# Altium schematic sheet Power.SchDoc
size 584 x 381 mm
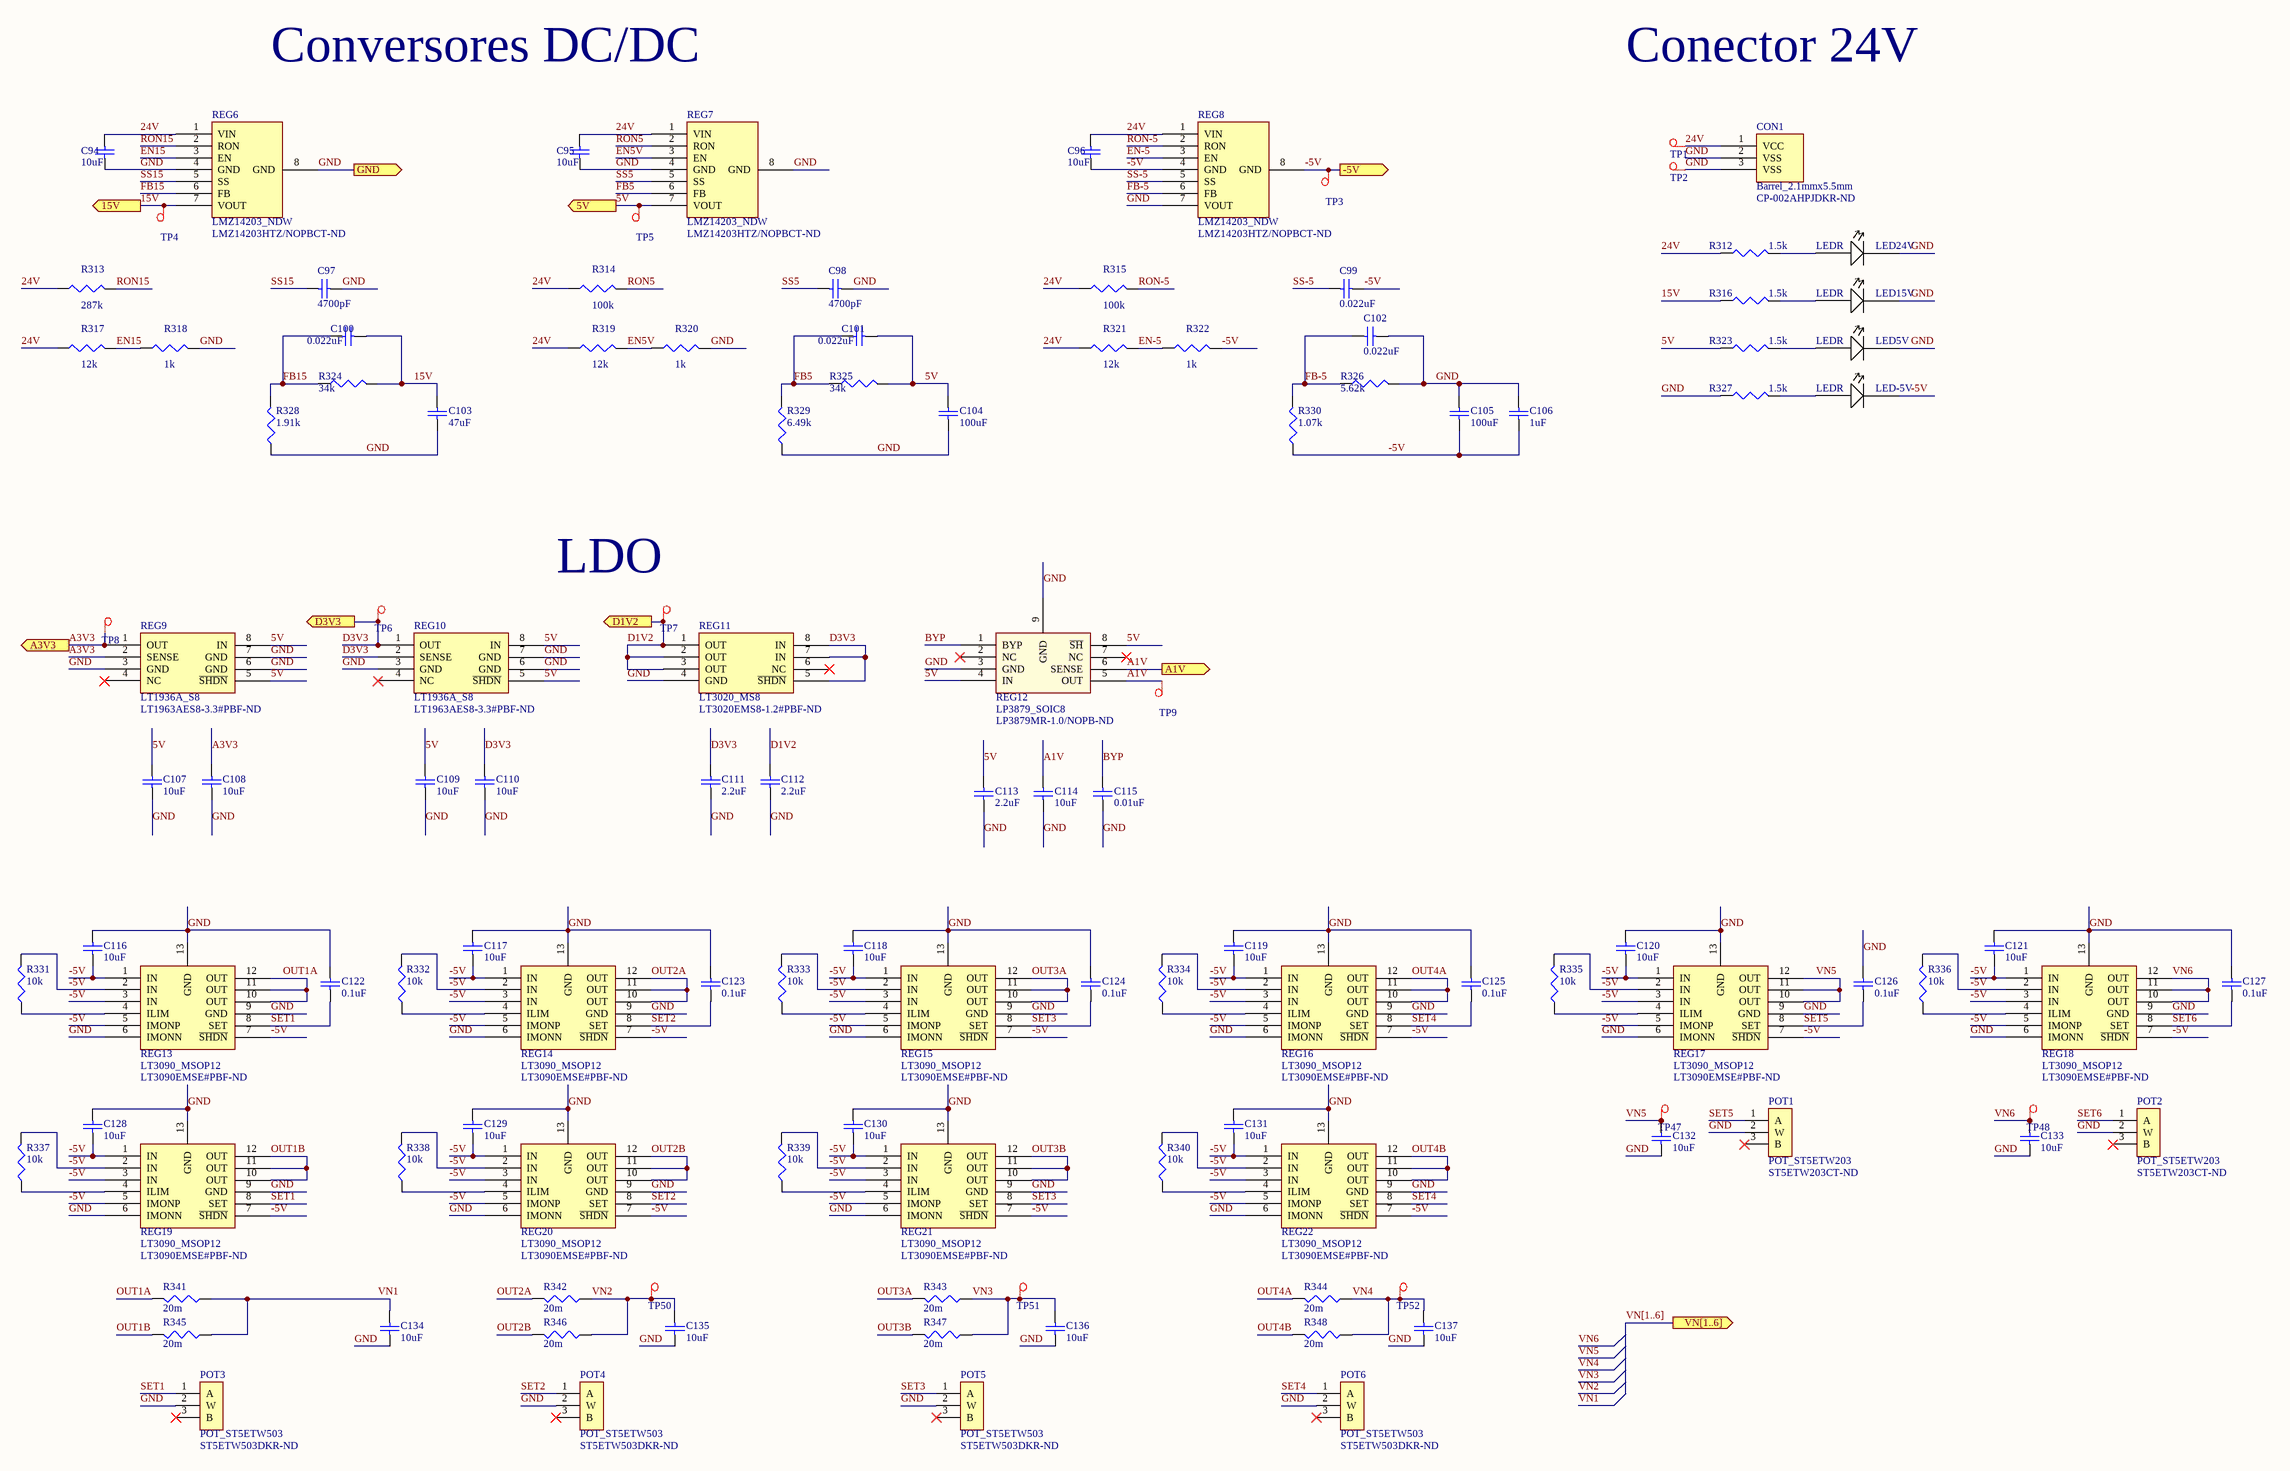
[diagram p0: Power.SchDoc]

## Parts
C94  value 10uF  [RES_1206]  (hidden comment: Cap)
C95  value 10uF  [RES_1206]  (hidden comment: Cap)
C96  value 10uF  [RES_1206]  (hidden comment: Cap)
C97  value 4700pF  [J1-0603]  (hidden comment: Cap)
C98  value 4700pF  [J1-0603]  (hidden comment: Cap)
C99  value 0.022uF  [J1-0603]  (hidden comment: Cap)
C100  value 0.022uF  [J1-0603]  (hidden comment: Cap)
C101  value 0.022uF  [J1-0603]  (hidden comment: Cap)
C102  value 0.022uF  [J1-0603]  (hidden comment: Cap)
C103  value 47uF  [RES_1206]  (hidden comment: Cap)
C104  value 100uF  [J1-0603]  (hidden comment: Cap)
C105  value 100uF  [J1-0603]  (hidden comment: Cap)
C106  value 1uF  [J1-0603]  (hidden comment: Cap)
C107  value 10uF  [RES_0805]  (hidden comment: Cap)
C108  value 10uF  [RES_0805]  (hidden comment: Cap)
C109  value 10uF  [RES_0805]  (hidden comment: Cap)
C110  value 10uF  [RES_0805]  (hidden comment: Cap)
C111  value 2.2uF  [J1-0603]  (hidden comment: Cap)
C112  value 2.2uF  [J1-0603]  (hidden comment: Cap)
C113  value 2.2uF  [J1-0603]  (hidden comment: Cap)
C114  value 10uF  [RES_0805]  (hidden comment: Cap)
C115  value 0.01uF  [J1-0603]  (hidden comment: Cap)
C116  value 10uF  [RES_0805]  (hidden comment: Cap)
C117  value 10uF  [RES_0805]  (hidden comment: Cap)
C118  value 10uF  [RES_0805]  (hidden comment: Cap)
C119  value 10uF  [RES_0805]  (hidden comment: Cap)
C120  value 10uF  [RES_0805]  (hidden comment: Cap)
C121  value 10uF  [RES_0805]  (hidden comment: Cap)
C122  value 0.1uF  [J1-0603]  (hidden comment: Cap)
C123  value 0.1uF  [J1-0603]  (hidden comment: Cap)
C124  value 0.1uF  [J1-0603]  (hidden comment: Cap)
C125  value 0.1uF  [J1-0603]  (hidden comment: Cap)
C126  value 0.1uF  [J1-0603]  (hidden comment: Cap)
C127  value 0.1uF  [J1-0603]  (hidden comment: Cap)
C128  value 10uF  [RES_0805]  (hidden comment: Cap)
C129  value 10uF  [RES_0805]  (hidden comment: Cap)
C130  value 10uF  [RES_0805]  (hidden comment: Cap)
C131  value 10uF  [RES_0805]  (hidden comment: Cap)
C132  value 10uF  [RES_0805]  (hidden comment: Cap)
C133  value 10uF  [RES_0805]  (hidden comment: Cap)
C134  value 10uF  [RES_0805]  (hidden comment: Cap)
C135  value 10uF  [RES_0805]  (hidden comment: Cap)
C136  value 10uF  [RES_0805]  (hidden comment: Cap)
C137  value 10uF  [RES_0805]  (hidden comment: Cap)
CON1  Barrel_2.1mmx5.5mm  Supplier Part Number 1: CP-002AHPJDKR-ND  [Barrel_2.1mmx5.5mm]
LED5V  LEDR  [LED]
LED15V  LEDR  [LED]
LED24V  LEDR  [LED]
LED-5V  LEDR  [LED]
POT1  POT_ST5ETW203  Supplier Part Number 1: ST5ETW203CT-ND  [POT_ST5ETW]
POT2  POT_ST5ETW203  Supplier Part Number 1: ST5ETW203CT-ND  [POT_ST5ETW]
POT3  POT_ST5ETW503  Supplier Part Number 1: ST5ETW503DKR-ND  [POT_ST5ETW]
POT4  POT_ST5ETW503  Supplier Part Number 1: ST5ETW503DKR-ND  [POT_ST5ETW]
POT5  POT_ST5ETW503  Supplier Part Number 1: ST5ETW503DKR-ND  [POT_ST5ETW]
POT6  POT_ST5ETW503  Supplier Part Number 1: ST5ETW503DKR-ND  [POT_ST5ETW]
R312  value 1.5k  [J1-0603]  (hidden comment: Res3)
R313  value 287k  [J1-0603]  (hidden comment: Res3)
R314  value 100k  [J1-0603]  (hidden comment: Res3)
R315  value 100k  [J1-0603]  (hidden comment: Res3)
R316  value 1.5k  [J1-0603]  (hidden comment: Res3)
R317  value 12k  [J1-0603]  (hidden comment: Res3)
R318  value 1k  [J1-0603]  (hidden comment: Res3)
R319  value 12k  [J1-0603]  (hidden comment: Res3)
R320  value 1k  [J1-0603]  (hidden comment: Res3)
R321  value 12k  [J1-0603]  (hidden comment: Res3)
R322  value 1k  [J1-0603]  (hidden comment: Res3)
R323  value 1.5k  [J1-0603]  (hidden comment: Res3)
R324  value 34k  [J1-0603]  (hidden comment: Res3)
R325  value 34k  [J1-0603]  (hidden comment: Res3)
R326  value 5.62k  [J1-0603]  (hidden comment: Res3)
R327  value 1.5k  [J1-0603]  (hidden comment: Res3)
R328  value 1.91k  [J1-0603]  (hidden comment: Res3)
R329  value 6.49k  [J1-0603]  (hidden comment: Res3)
R330  value 1.07k  [J1-0603]  (hidden comment: Res3)
R331  value 10k  [J1-0603]  (hidden comment: Res3)
R332  value 10k  [J1-0603]  (hidden comment: Res3)
R333  value 10k  [J1-0603]  (hidden comment: Res3)
R334  value 10k  [J1-0603]  (hidden comment: Res3)
R335  value 10k  [J1-0603]  (hidden comment: Res3)
R336  value 10k  [J1-0603]  (hidden comment: Res3)
R337  value 10k  [J1-0603]  (hidden comment: Res3)
R338  value 10k  [J1-0603]  (hidden comment: Res3)
R339  value 10k  [J1-0603]  (hidden comment: Res3)
R340  value 10k  [J1-0603]  (hidden comment: Res3)
R341  value 20m  [J1-0603]  (hidden comment: Res3)
R342  value 20m  [J1-0603]  (hidden comment: Res3)
R343  value 20m  [J1-0603]  (hidden comment: Res3)
R344  value 20m  [J1-0603]  (hidden comment: Res3)
R345  value 20m  [J1-0603]  (hidden comment: Res3)
R346  value 20m  [J1-0603]  (hidden comment: Res3)
R347  value 20m  [J1-0603]  (hidden comment: Res3)
R348  value 20m  [J1-0603]  (hidden comment: Res3)
REG6  LMZ14203_NDW  Supplier Part Number 1: LMZ14203HTZ/NOPBCT-ND  [LMZ14203_NDW]
REG7  LMZ14203_NDW  Supplier Part Number 1: LMZ14203HTZ/NOPBCT-ND  [LMZ14203_NDW]
REG8  LMZ14203_NDW  Supplier Part Number 1: LMZ14203HTZ/NOPBCT-ND  [LMZ14203_NDW]
REG9  LT1936A_S8  Supplier Part Number 1: LT1963AES8-3.3#PBF-ND  [LT1936A_S8]
REG10  LT1936A_S8  Supplier Part Number 1: LT1963AES8-3.3#PBF-ND  [LT1936A_S8]
REG11  LT3020_MS8  Supplier Part Number 1: LT3020EMS8-1.2#PBF-ND  [LT3020_MS8]
REG12  LP3879_SOIC8  Supplier Part Number 1: LP3879MR-1.0/NOPB-ND  [LP3879_SOIC8]
REG13  LT3090_MSOP12  Supplier Part Number 1: LT3090EMSE#PBF-ND  [LT3090_MSOP12]
REG14  LT3090_MSOP12  Supplier Part Number 1: LT3090EMSE#PBF-ND  [LT3090_MSOP12]
REG15  LT3090_MSOP12  Supplier Part Number 1: LT3090EMSE#PBF-ND  [LT3090_MSOP12]
REG16  LT3090_MSOP12  Supplier Part Number 1: LT3090EMSE#PBF-ND  [LT3090_MSOP12]
REG17  LT3090_MSOP12  Supplier Part Number 1: LT3090EMSE#PBF-ND  [LT3090_MSOP12]
REG18  LT3090_MSOP12  Supplier Part Number 1: LT3090EMSE#PBF-ND  [LT3090_MSOP12]
REG19  LT3090_MSOP12  Supplier Part Number 1: LT3090EMSE#PBF-ND  [LT3090_MSOP12]
REG20  LT3090_MSOP12  Supplier Part Number 1: LT3090EMSE#PBF-ND  [LT3090_MSOP12]
REG21  LT3090_MSOP12  Supplier Part Number 1: LT3090EMSE#PBF-ND  [LT3090_MSOP12]
REG22  LT3090_MSOP12  Supplier Part Number 1: LT3090EMSE#PBF-ND  [LT3090_MSOP12]
TP1  Test Point  [TestPoint]  (value not drawn)
TP2  Test Point  [TestPoint]  (value not drawn)
TP3  Test Point  [TestPoint]  (value not drawn)
TP4  Test Point  [TestPoint]  (value not drawn)
TP5  Test Point  [TestPoint]  (value not drawn)
TP6  Test Point  [TestPoint]  (value not drawn)
TP7  Test Point  [TestPoint]  (value not drawn)
TP8  Test Point  [TestPoint]  (value not drawn)
TP9  Test Point  [TestPoint]  (value not drawn)
TP47  Test Point  [TestPoint]  (value not drawn)
TP48  Test Point  [TestPoint]  (value not drawn)
TP50  Test Point  [TestPoint]  (value not drawn)
TP51  Test Point  [TestPoint]  (value not drawn)
TP52  Test Point  [TestPoint]  (value not drawn)

## Ports
5V (out), 15V (out), -5V (out), A1V (out), A3V3 (out), D1V2 (out), D3V3 (out), GND (out), VN[1..6] (out)

## Nets
5V: C101.1 C104.1 C107.1 C109.1 C113.1 R323.1 R325.2 REG7.7(VOUT) REG9.5(~{SHDN}) REG9.8(IN) REG10.5(~{SHDN}) REG10.8(IN) REG12.4(IN) REG12.8(~{SH}) TP5.1(TP) ; port 5V
15V: C100.1 C103.1 R316.1 R324.2 REG6.7(VOUT) TP4.1(TP) ; port 15V
24V: C94.2 C95.2 C96.2 CON1.1(VCC) R312.1 R313.1 R314.1 R315.1 R317.1 R319.1 R321.1 REG6.1(VIN) REG7.1(VIN) REG8.1(VIN) TP1.1(TP)
-5V: C96.1 C99.1 C105.2 C106.2 C116.2 C117.2 C118.2 C119.2 C120.2 C121.2 C128.2 C129.2 C130.2 C131.2 LED-5V.2 R322.2 R330.1 R331.2 R332.2 R333.2 R334.2 R335.2 R336.2 R337.2 R338.2 R339.2 R340.2 REG8.4(GND) REG8.8(GND) REG13.1(IN) REG13.2(IN) REG13.3(IN) REG13.5(IMONP) REG13.7(~{SHDN}) REG14.1(IN) REG14.2(IN) REG14.3(IN) REG14.5(IMONP) REG14.7(~{SHDN}) REG15.1(IN) REG15.2(IN) REG15.3(IN) REG15.5(IMONP) REG15.7(~{SHDN}) REG16.1(IN) REG16.2(IN) REG16.3(IN) REG16.5(IMONP) REG16.7(~{SHDN}) REG17.1(IN) REG17.2(IN) REG17.3(IN) REG17.5(IMONP) REG17.7(~{SHDN}) REG18.1(IN) REG18.2(IN) REG18.3(IN) REG18.5(IMONP) REG18.7(~{SHDN}) REG19.1(IN) REG19.2(IN) REG19.3(IN) REG19.5(IMONP) REG19.7(~{SHDN}) REG20.1(IN) REG20.2(IN) REG20.3(IN) REG20.5(IMONP) REG20.7(~{SHDN}) REG21.1(IN) REG21.2(IN) REG21.3(IN) REG21.5(IMONP) REG21.7(~{SHDN}) REG22.1(IN) REG22.2(IN) REG22.3(IN) REG22.5(IMONP) REG22.7(~{SHDN}) TP3.1(TP) ; port -5V
A1V: C114.1 REG12.5(OUT) REG12.6(SENSE) TP9.1(TP) ; port A1V
A3V3: C108.1 REG9.1(OUT) REG9.2(SENSE) TP8.1(TP) ; port A3V3
BYP: C115.1 REG12.1(BYP)
D1V2: C112.1 REG11.1(OUT) REG11.2(OUT) REG11.3(OUT) TP7.1(TP) ; port D1V2
D3V3: C110.1 C111.1 REG10.1(OUT) REG10.2(SENSE) REG11.5(~{SHDN}) REG11.7(IN) REG11.8(IN) TP6.1(TP) ; port D3V3
EN5V: R319.2 R320.1 REG7.3(EN)
EN15: R317.2 R318.1 REG6.3(EN)
EN-5: R321.2 R322.1 REG8.3(EN)
FB5: C101.2 R325.1 R329.2 REG7.6(FB)
FB15: C100.2 R324.1 R328.2 REG6.6(FB)
FB-5: C102.2 R326.1 R330.2 REG8.6(FB)
GND: C94.1 C95.1 C97.1 C98.1 C102.1 C103.2 C104.2 C105.1 C106.1 C107.2 C108.2 C109.2 C110.2 C111.2 C112.2 C113.2 C114.2 C115.2 C116.1 C117.1 C118.1 C119.1 C120.1 C121.1 C122.1 C123.1 C124.1 C125.1 C126.1 C127.1 C128.1 C129.1 C130.1 C131.1 C132.2 C133.2 C134.2 C135.2 C136.2 C137.2 CON1.2(VSS) CON1.3(VSS) LED5V.2 LED15V.2 LED24V.2 POT1.2(W) POT2.2(W) POT3.2(W) POT4.2(W) POT5.2(W) POT6.2(W) R318.2 R320.2 R326.2 R327.1 R328.1 R329.1 REG6.4(GND) REG6.8(GND) REG7.4(GND) REG7.8(GND) REG8.7(VOUT) REG9.3(GND) REG9.6(GND) REG9.7(GND) REG10.3(GND) REG10.6(GND) REG10.7(GND) REG11.4(GND) REG12.3(GND) REG12.9(GND) REG13.6(IMONN) REG13.9(GND) REG13.13(GND) REG14.6(IMONN) REG14.9(GND) REG14.13(GND) REG15.6(IMONN) REG15.9(GND) REG15.13(GND) REG16.6(IMONN) REG16.9(GND) REG16.13(GND) REG17.6(IMONN) REG17.9(GND) REG17.13(GND) REG18.6(IMONN) REG18.9(GND) REG18.13(GND) REG19.6(IMONN) REG19.9(GND) REG19.13(GND) REG20.6(IMONN) REG20.9(GND) REG20.13(GND) REG21.6(IMONN) REG21.9(GND) REG21.13(GND) REG22.6(IMONN) REG22.9(GND) REG22.13(GND) TP2.1(TP) ; port GND
OUT1A: R341.2 REG13.10(OUT) REG13.11(OUT) REG13.12(OUT)
OUT1B: R345.2 REG19.10(OUT) REG19.11(OUT) REG19.12(OUT)
OUT2A: R342.2 REG14.10(OUT) REG14.11(OUT) REG14.12(OUT)
OUT2B: R346.2 REG20.10(OUT) REG20.11(OUT) REG20.12(OUT)
OUT3A: R343.2 REG15.10(OUT) REG15.11(OUT) REG15.12(OUT)
OUT3B: R347.2 REG21.10(OUT) REG21.11(OUT) REG21.12(OUT)
OUT4A: R344.2 REG16.10(OUT) REG16.11(OUT) REG16.12(OUT)
OUT4B: R348.2 REG22.10(OUT) REG22.11(OUT) REG22.12(OUT)
RON5: R314.2 REG7.2(RON)
RON15: R313.2 REG6.2(RON)
RON-5: R315.2 REG8.2(RON)
SET1: C122.2 POT3.1(A) REG13.8(SET) REG19.8(SET)
SET2: C123.2 POT4.1(A) REG14.8(SET) REG20.8(SET)
SET3: C124.2 POT5.1(A) REG15.8(SET) REG21.8(SET)
SET4: C125.2 POT6.1(A) REG16.8(SET) REG22.8(SET)
SET5: C126.2 POT1.1(A) REG17.8(SET)
SET6: C127.2 POT2.1(A) REG18.8(SET)
SS5: C98.2 REG7.5(SS)
SS15: C97.2 REG6.5(SS)
SS-5: C99.2 REG8.5(SS)
VN1: C134.1 R341.1 R345.1
VN2: C135.1 R342.1 R346.1 TP50.1(TP)
VN3: C136.1 R343.1 R347.1 TP51.1(TP)
VN4: C137.1 R344.1 R348.1 TP52.1(TP)
VN5: C132.1 REG17.10(OUT) REG17.11(OUT) REG17.12(OUT) TP47.1(TP)
VN6: C133.1 REG18.10(OUT) REG18.11(OUT) REG18.12(OUT) TP48.1(TP)
NetLED5V_1: LED5V.1 R323.2
NetLED15V_1: LED15V.1 R316.2
NetLED24V_1: LED24V.1 R312.2
NetLED-5V_1: LED-5V.1 R327.2
NetR331_1: R331.1 REG13.4(ILIM)
NetR332_1: R332.1 REG14.4(ILIM)
NetR333_1: R333.1 REG15.4(ILIM)
NetR334_1: R334.1 REG16.4(ILIM)
NetR335_1: R335.1 REG17.4(ILIM)
NetR336_1: R336.1 REG18.4(ILIM)
NetR337_1: R337.1 REG19.4(ILIM)
NetR338_1: R338.1 REG20.4(ILIM)
NetR339_1: R339.1 REG21.4(ILIM)
NetR340_1: R340.1 REG22.4(ILIM)

Not connected (* = marked no-connect by the designer): POT1 3(B)*; POT2 3(B)*; POT3 3(B)*; POT4 3(B)*; POT5 3(B)*; POT6 3(B)*; REG9 4(NC)*; REG10 4(NC)*; REG11 6(NC)*; REG12 2(NC)* 7(NC)*

## Buses and harness runs
bus VN[1..6] = port VN[1..6]

## Notes on the sheet
- Conversores DC/DC
- Conector 24V
- (near TP7) LDO

## Library data of the parts
C94-C137 = Cap: Capacitor; Published: 8-Jun-2000; LatestRevisionDate: 17-Jul-2002; LatestRevisionNote: Re-released for DXP Platform.; PackageReference: RAD-0.3; Publisher: Altium Limited; PackageDescription: Radial Cap, Thru-Hole; 2 Leads; 0.3 in Pin Spacing; Supplier 1: Digi-Key
  C94-C96: Supplier Part Number 1: 587-3248-1-ND
  C97 C98: Supplier Part Number 1: 1276-2061-1-ND
  C99-C102: Supplier Part Number 1: 1276-1995-1-ND
  C103: Supplier Part Number 1: 445-8047-1-ND
  C104 C105: Supplier Part Number 1: 1276-1782-1-ND
  C106: Supplier Part Number 1: 1276-1946-1-ND
  C107-C110 C114 C116-C121 C128-C137: Supplier Part Number 1: 490-3340-1-ND
  C111-C113: Supplier Part Number 1: 587-1254-1-ND
  C115: Supplier Part Number 1: 1276-1785-1-ND
  C122-C127: Supplier Part Number 1: 490-1532-1-ND
R312-R348 = Res3: Resistor; Published: 8-Jun-2000; LatestRevisionDate: 29-May-2009; LatestRevisionNote: IPC-7351 Footprint Added.; PackageReference: J1-0603; Publisher: Altium Limited; PackageDescription: Chip Resistor; Supplier 1: Digi-Key
  R312 R316 R323 R327: Supplier Part Number 1: RMCF0603JT1K50CT-ND
  R313: Supplier Part Number 1: P287KHCT-ND
  R314 R315: Supplier Part Number 1: P100KHCT-ND
  R317 R319 R321: Supplier Part Number 1: RHM12.0KCLCT-ND
  R318 R320 R322: Supplier Part Number 1: P1.0KGCT-ND
  R324 R325: Supplier Part Number 1: RMCF0603FT34K0CT-ND
  R326: Supplier Part Number 1: P5.62KHCT-ND
  R328: Supplier Part Number 1: RHM1.91KCFCT-ND
  R329: Supplier Part Number 1: 311-6.49KHRCT-ND
  R330: Supplier Part Number 1: RHM1.07KCFCT-ND
  R331-R340: Supplier Part Number 1: RHM10.0KCFCT-ND
  R341-R348: Supplier Part Number 1: 1276-6153-1-ND
CON1 = Barrel_2.1mmx5.5mm: Supplier 1: Digi-Key
LED5V LED15V LED24V LED-5V = LEDR: Supplier 1: Digi-Key; Supplier Part Number 1: 160-1447-1-ND
POT1 POT2 = POT_ST5ETW203: Supplier 1: Digi-Key
POT3-POT6 = POT_ST5ETW503: Supplier 1: Digi-Key
REG6-REG8 = LMZ14203_NDW: Supplier 1: Digi-Key
REG9 REG10 = LT1936A_S8: Supplier 1: Digi-Key
REG11 = LT3020_MS8: Supplier 1: Digi-Key
REG12 = LP3879_SOIC8: Supplier 1: Digi-Key
REG13-REG22 = LT3090_MSOP12: Supplier 1: Digi-Key
TP1-TP9 TP47 TP48 TP50-TP52 = Test Point: Supplier 1: Digi-Key; Supplier Part Number 1: 36-5019CT-ND